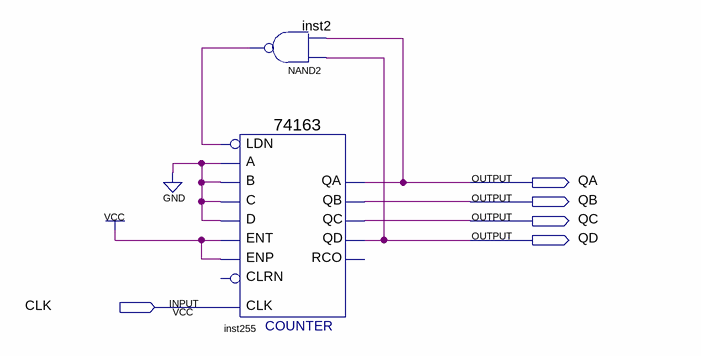
[diagram p0: schematic sheet]
// Quartus schematic SpecialCount0_9.bdf as structural Verilog: 2 symbols, 5 pins
module SpecialCount0_9 (
  input  CLK,
  output QA,
  output QB,
  output QC,
  output QD
);

  wire inst2_out;

  \74163  inst255 (
    .C(1'b0), .B(1'b0), .A(1'b0), .ENT(1'b1), .D(1'b0), .CLK(CLK), .ENP(1'b1), .LDN(inst2_out), .QA(QA),
    .QB(QB), .QC(QC), .QD(QD));  // open: CLRN, RCO
  nand inst2 (inst2_out, QD, QA);
endmodule
